# EasyEDA Pro project ProPrj_hackpod.epro

# Schematic Schematic1
Board Name: Board1; Create Date: 2025-11-21; Page Name: P1; Project Name: hackpod; Schematic Name: Schematic1; Update Date: 2025-11-21; Company: wenfeng110402; Drawed: 叶文峰; Page Size: A4; Reviewed: 叶文峰; Version: V1.0
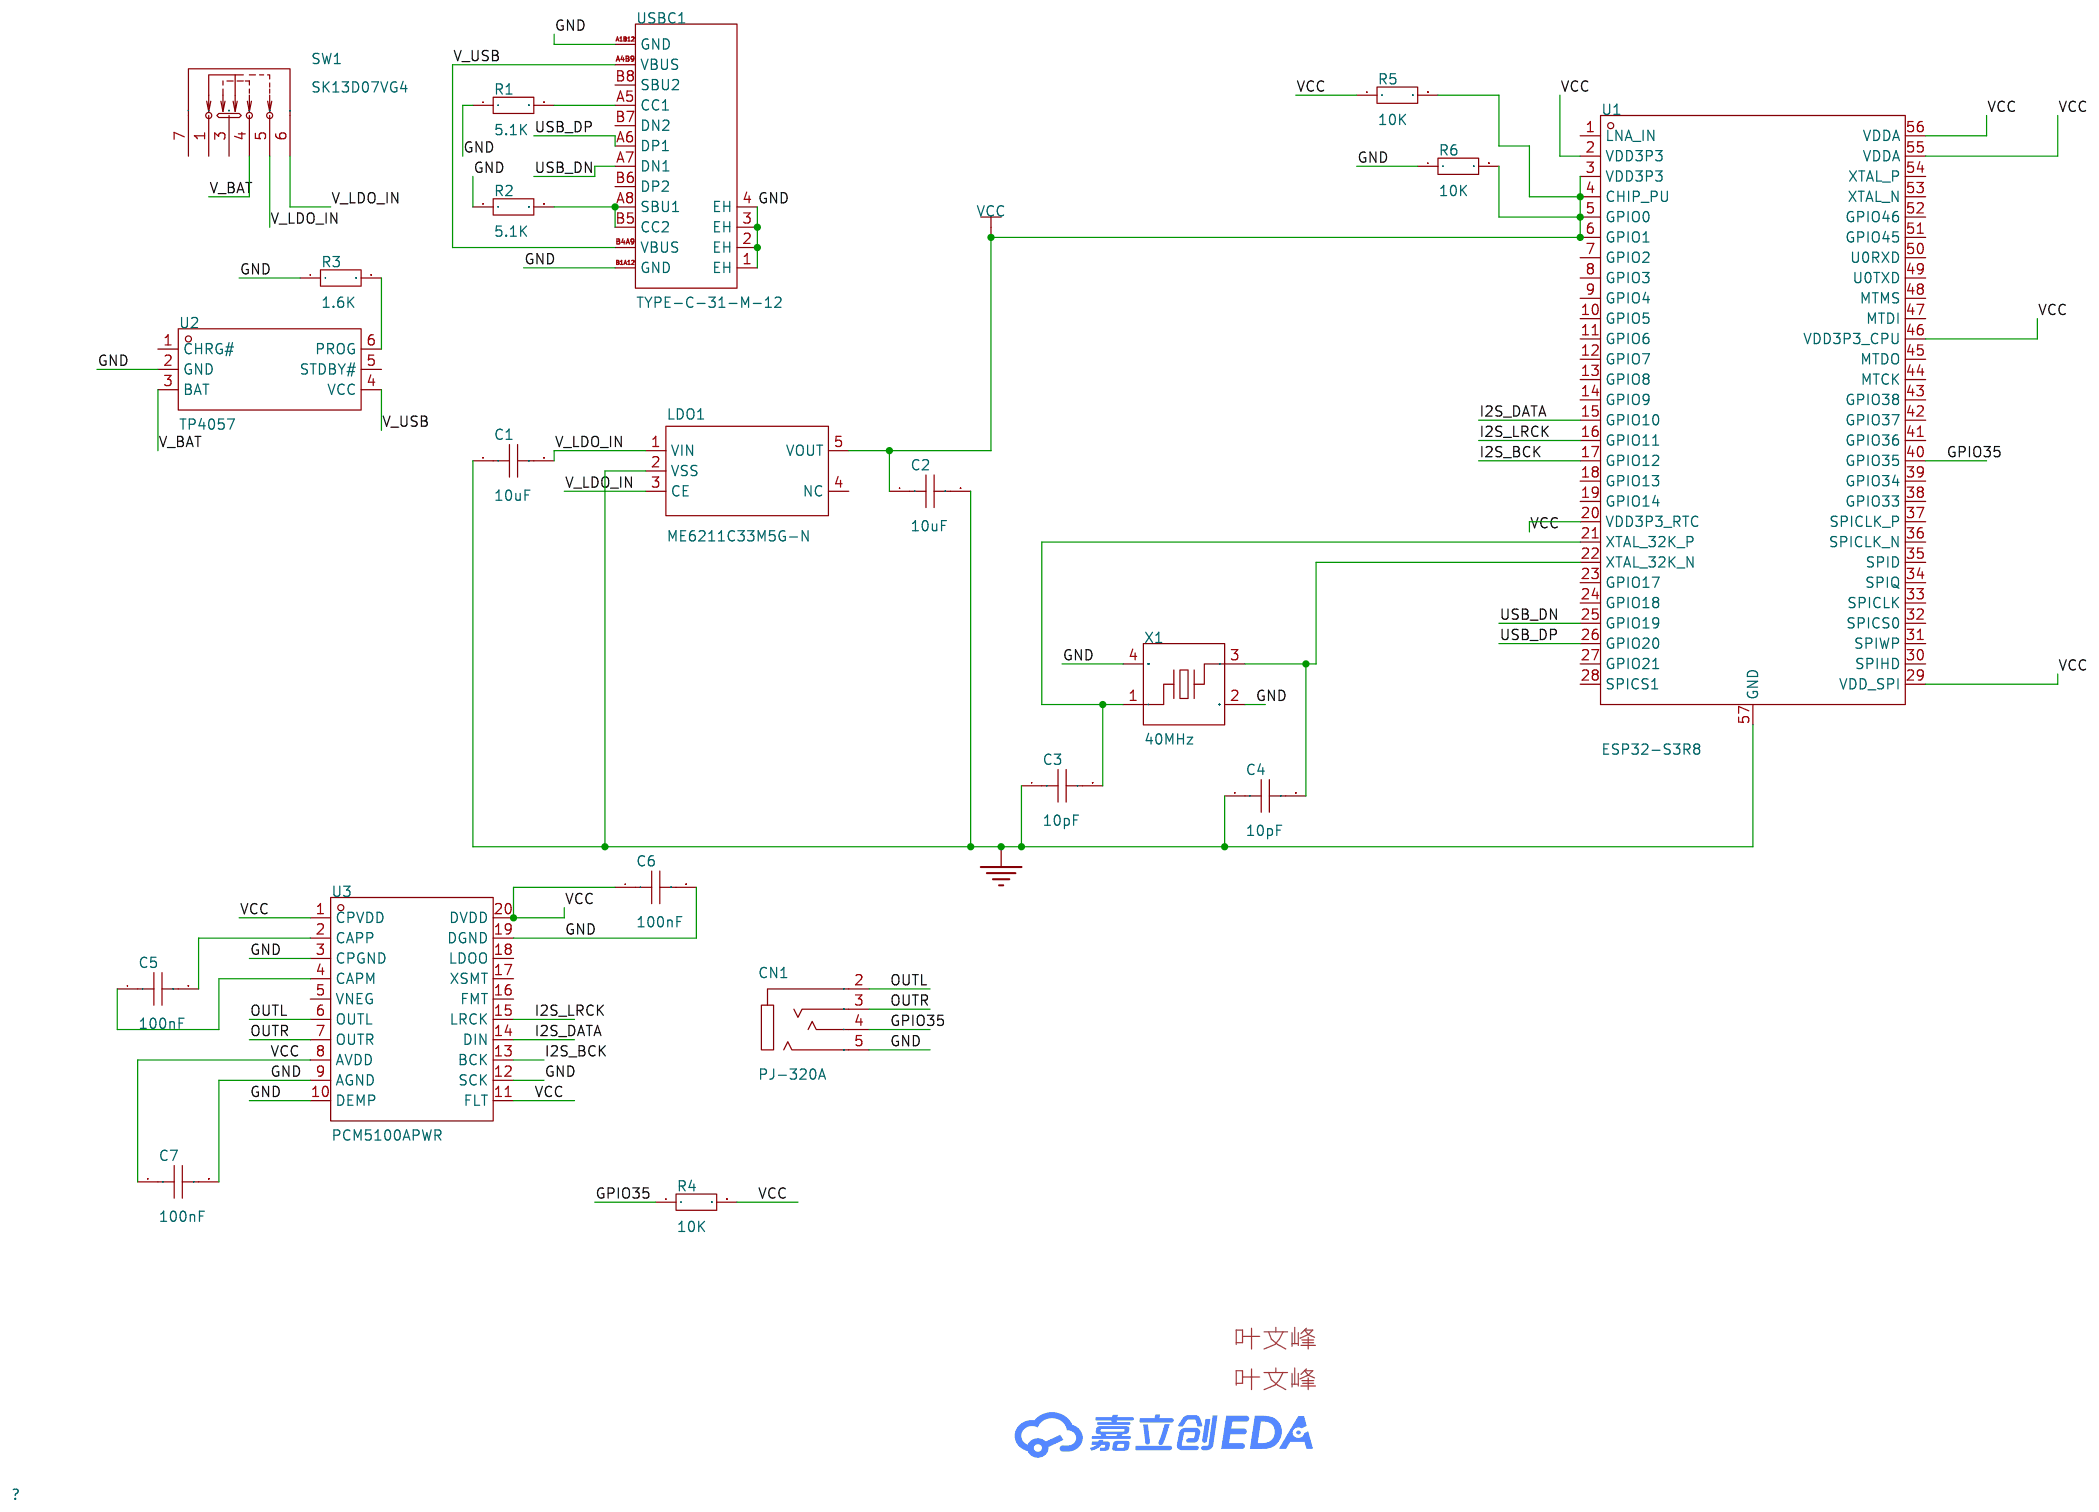
[diagram p0: schematic sheet]

## Parts
C1  10uF  [C0603]
C2  10uF  [C0603]
C3  10pF  [C0603]
C4  10pF  [C0603]
C5  100nF  [C0603]
C6  100nF  [C0603]
C7  100nF  [C0603]
CN1  PJ-320A  [AUDIO-TH_PJ-320A_C49284721]
LDO1  ME6211C33M5G-N  [SOT-23-5_L3.0-W1.7-P0.95-LS2.8-BL]
R1  5.1K  [R0603]
R2  5.1K  [R0603]
R3  1.6K  [R0603]
R4  10K  [R0603]
R5  10K  [R0603]
R6  10K  [R0603]
SW1  SK13D07VG4  [SW-TH_SK13D07VG4]
U1  ESP32-S3R8  [QFN-56_L7.0-W7.0-P0.40-TL-EP4.0]
U2  TP4057  [SOT-23-6_L2.9-W1.6-P0.95-LS2.8-BR]
U3  PCM5100APWR  [TSSOP-20_L6.5-W4.4-P0.65-LS6.4-BL]
USBC1  TYPE-C-31-M-12  [USB-C_SMD-TYPE-C-31-M-12_1]
X1  40MHz  [CRYSTAL-SMD_4P-L3.2-W2.5-BL]

## Library data of the parts
C1-C7 = CAP_0603: Supplier Footprint: 0603
CN1 = PJ-320A_C49284721: 连接器类型:3.5mm耳机座;额定电流:500mA;额定电压:30V;触头材质:铜;触头镀层:金;工作温度:-25℃~+85℃;; LCSC Part Name: 3.5mm耳机座; Supplier Part: C49284721; Manufacturer: XUNPU(讯普); Supplier Footprint: SMD; JLCPCB Part Class: 扩展库; Datasheet: https://item.szlcsc.com/datasheet/PJ-320A/51736270.html; Supplier: LCSC; Connector Type: 3.5mm耳机座; Current Rating: 500mA; Voltage Rating (Max): 30V; Contact Material: 铜; Contact Plating: 金; Operating Temperature: -25℃~+85℃
LDO1 = ME6211C33M5G-N: 输出类型:固定;工作电压:6V;输出电压:3.3V;输出电流:500mA;电源纹波抑制比(PSRR):70dB@(1kHz);输出极性:正极;; LCSC Part Name: 输入6V 输出3.3V 500mA; Supplier Part: C82942; Manufacturer: MICRONE(南京微盟); Supplier Footprint: SOT-23-5; JLCPCB Part Class: 扩展库; Datasheet: https://item.szlcsc.com/datasheet/ME6211C33M5G-N/84106.html; Supplier: LCSC; Output Type: 固定; Voltage - Supply: 6V; Output Voltage: 3.3V; Output Current: 500mA; Power Supply Rejection Ratio (PSRR): 70dB@(1kHz); Voltage Dropout: 120mV@(100mA); standby current: 60uA; Noise: 50uVrms; Features: 过流保护；带使能；短路保护; Operating Temperature: -40℃~+150℃; Output Configuration: 正极; Number of Outputs: 1
R1-R6 = Res_0603: Supplier Footprint: 0603
SW1 = SK13D07VG4: 电路结构:单刀三掷;安装方式:-;开关颜色:-;额定电流:300mA;额定电压:50V;工作寿命:5千次;; LCSC Part Name: 4脚3三档位SK13D07VG2 1P3T卧式拨动开关,柄长4MM; Supplier Part: C2681581; Manufacturer: SHOU HAN(首韩); Supplier Footprint: 插件,12.6x4.4mm; JLCPCB Part Class: 扩展库; Datasheet: https://item.szlcsc.com/datasheet/SK13D07VG4/2774924.html; Supplier: LCSC; Circuit: 单刀三掷; Termination Style: PC引脚; Length: 12.6mm; Width: 4.4mm; Switch Height: 4.7mm; Current Rating: 300mA; Voltage Rating: 50V; Life: 5千次; Operating Temperature: -10℃~+50℃
U1 = ESP32-S3R8: 频率范围:2.412GHz~2.484GHz;接口类型:I2C；I2S；UART；USB；SPI;应用领域:蓝牙；IoT；WiFi;数据速率:150Mbps;灵敏度:-74.2dBm;典型应用频率:2.4GHz;; LCSC Part Name: 2.4GHz Wi-Fi + 低功耗蓝牙系统级芯片（SoC）; Supplier Part: C2913194; Manufacturer: ESPRESSIF(乐鑫); Supplier Footprint: QFN-56(7x7); JLCPCB Part Class: 扩展库; Datasheet: https://item.szlcsc.com/datasheet/ESP32-S3R8/3198292.html; Supplier: LCSC; Frequency Range: 2.412GHz~2.484GHz; Interface: I2C；I2S；UART；USB；SPI; Voltage - Supply: 3V~3.6V; Applications: 蓝牙；IoT；WiFi; Output Power: 18.5dBm; Data Rate: 150Mbps; Current Of Transmitting: 283mA; Sensitivity: -74.2dBm; Receive Current: 88mA; Typical Application Frequency: 2.4GHz; Operating Temperature: -40℃~+65℃; Type: 收发器
U2 = TP4057: 工作电压:4V~6.5V;最大充电电流:500mA;电池类型:锂离子;电池节数:1;; Supplier Part: C725791; Manufacturer: UMW(友台半导体); Supplier Footprint: SOT-23-6; JLCPCB Part Class: 扩展库; Datasheet: https://item.szlcsc.com/datasheet/TP4057/772194.html; Supplier: LCSC; The Chip Type: 充电芯片; Voltage - Supply: 4V~6.5V; Charge Current - Max: 500mA; Charging Saturation Voltage: 4.24V; Type of Battery: 锂离子; Number of Cells: 1; Operating Temperature: -40℃~+85℃; Battery Temperature Detection: 支持; Supply Current (Iq): 25uA
U3 = PCM5100APWR: 工作电压:1.8V~3.3V;接口类型:I2S;; LCSC Part Name: 具有PLL和32位、384kHz PCM接口的音频立体声DAC; Supplier Part: C131154; Manufacturer: TI(德州仪器); Supplier Footprint: TSSOP-20; JLCPCB Part Class: 扩展库; Datasheet: https://www.ti.com/cn/lit/gpn/pcm5102a; Supplier: LCSC; Voltage - Supply: 1.8V~3.3V; Interface Type: I2S
USBC1 = TYPE-C-31-M-12: 连接器类型:Type-C;协议标准:-;公母:母;安装方式:-;触点数量:16P;端口数量:1;额定电流 - 电源:5A;工作温度:-;; LCSC Part Name: Type-C 母; Supplier Part: C165948; Manufacturer: 韩国韩荣; Supplier Footprint: SMD; JLCPCB Part Class: 扩展库; Datasheet: https://item.szlcsc.com/datasheet/TYPE-C-31-M-12/177331.html; Supplier: LCSC; Connector Type: Type-C; Gender: 母; Number of Contacts: 16P; Number of Ports: 1; Current Rating-Power: 5A
X1 = XL2EL89CPI-111YLC-40M: 晶振类型:贴片晶振;频率:40MHz;常温频差:±10ppm;负载电容:15pF;频率稳定度:±20ppm;; LCSC Part Name: YSX321SL 40MHZ 4P 3225 15PF ±10PPM -40~85℃ (±20PPM); Supplier Part: C5444549; Manufacturer: YXC(扬兴晶振); Supplier Footprint: SMD3225-4P; JLCPCB Part Class: 扩展库; Datasheet: https://item.szlcsc.com/datasheet/XL2EL89CPI-111YLC-40M/6336545.html; Supplier: LCSC; Type: 贴片晶振; Normal temperature Frequency Tolerance: ±10ppm; Load Capacitance: 15pF; Frequency Stability: ±20ppm; Operating Temperature: -40℃~+85℃

## Nets
GND: C1.1 C2.2 C3.1 C4.1 C6.2 C7.2 CN1.5 LDO1.2(VSS) R1.1 R2.1 R3.1 R6.1 U1.57(GND) U2.2(GND) U3.3(CPGND) U3.9(AGND) U3.10(DEMP) U3.12(SCK) U3.19(DGND) USBC1.1(EH) USBC1.2(EH) USBC1.3(EH) USBC1.4(EH) USBC1.A1B12(GND) USBC1.B1A12(GND) X1.2(GND) X1.4(GND)
VCC: C2.1 C6.1 C7.1 LDO1.5(VOUT) R4.2 R5.1 R5.2 R6.2 U1.2(VDD3P3) U1.3(VDD3P3) U1.4(CHIP_PU) U1.5(GPIO0) U1.6(GPIO1) U1.20(VDD3P3_RTC) U1.29(VDD_SPI) U1.46(VDD3P3_CPU) U1.55(VDDA) U1.56(VDDA) U3.1(CPVDD) U3.8(AVDD) U3.11(FLT) U3.20(DVDD)
GPIO35: CN1.4 R4.1 U1.40(GPIO35)
I2S_BCK: U1.17(GPIO12) U3.13(BCK)
I2S_DATA: U1.15(GPIO10) U3.14(DIN)
I2S_LRCK: U1.16(GPIO11) U3.15(LRCK)
OUTL: CN1.2 U3.6(OUTL)
OUTR: CN1.3 U3.7(OUTR)
USB_DN: U1.25(GPIO19) USBC1.A7(DN1)
USB_DP: U1.26(GPIO20) USBC1.A6(DP1)
V_BAT: SW1.4 U2.3(BAT)
V_LDO_IN: C1.2 LDO1.1(VIN) LDO1.3(CE) SW1.5 SW1.6
V_USB: U2.4(VCC) USBC1.A4B9(VBUS) USBC1.B4A9(VBUS)
Net-(C3-2): C3.2 U1.21(XTAL_32K_P) X1.1
Net-(C4-2): C4.2 U1.22(XTAL_32K_N) X1.3
Net-(C5-1): C5.1 U3.4(CAPM)
Net-(C5-2): C5.2 U3.2(CAPP)
Net-(R1-2): R1.2 USBC1.A5(CC1)
Net-(R2-2): R2.2 USBC1.A8(SBU1) USBC1.B5(CC2)
Net-(R3-2): R3.2 U2.6(PROG)

Not connected (* = marked no-connect by the designer): LDO1 4(NC); SW1 1 3 7; U1 1(LNA_IN) 7(GPIO2) 8(GPIO3) 9(GPIO4) 10(GPIO5) 11(GPIO6) 12(GPIO7) 13(GPIO8) 14(GPIO9) 18(GPIO13) 19(GPIO14) 23(GPIO17) 24(GPIO18) 27(GPIO21) 28(SPICS1) 30(SPIHD) 31(SPIWP) 32(SPICS0) 33(SPICLK) 34(SPIQ) 35(SPID) 36(SPICLK_N) 37(SPICLK_P) 38(GPIO33) 39(GPIO34) 41(GPIO36) 42(GPIO37) 43(GPIO38) 44(MTCK) 45(MTDO) 47(MTDI) 48(MTMS) 49(U0TXD) 50(U0RXD) 51(GPIO45) 52(GPIO46) 53(XTAL_N) 54(XTAL_P); U2 1(CHRG#) 5(STDBY#); U3 5(VNEG) 16(FMT) 17(XSMT) 18(LDOO); USBC1 B6(DP2) B7(DN2) B8(SBU2)
